# EAGLE schematic remotecontroll (EAGLE 9.2.2)
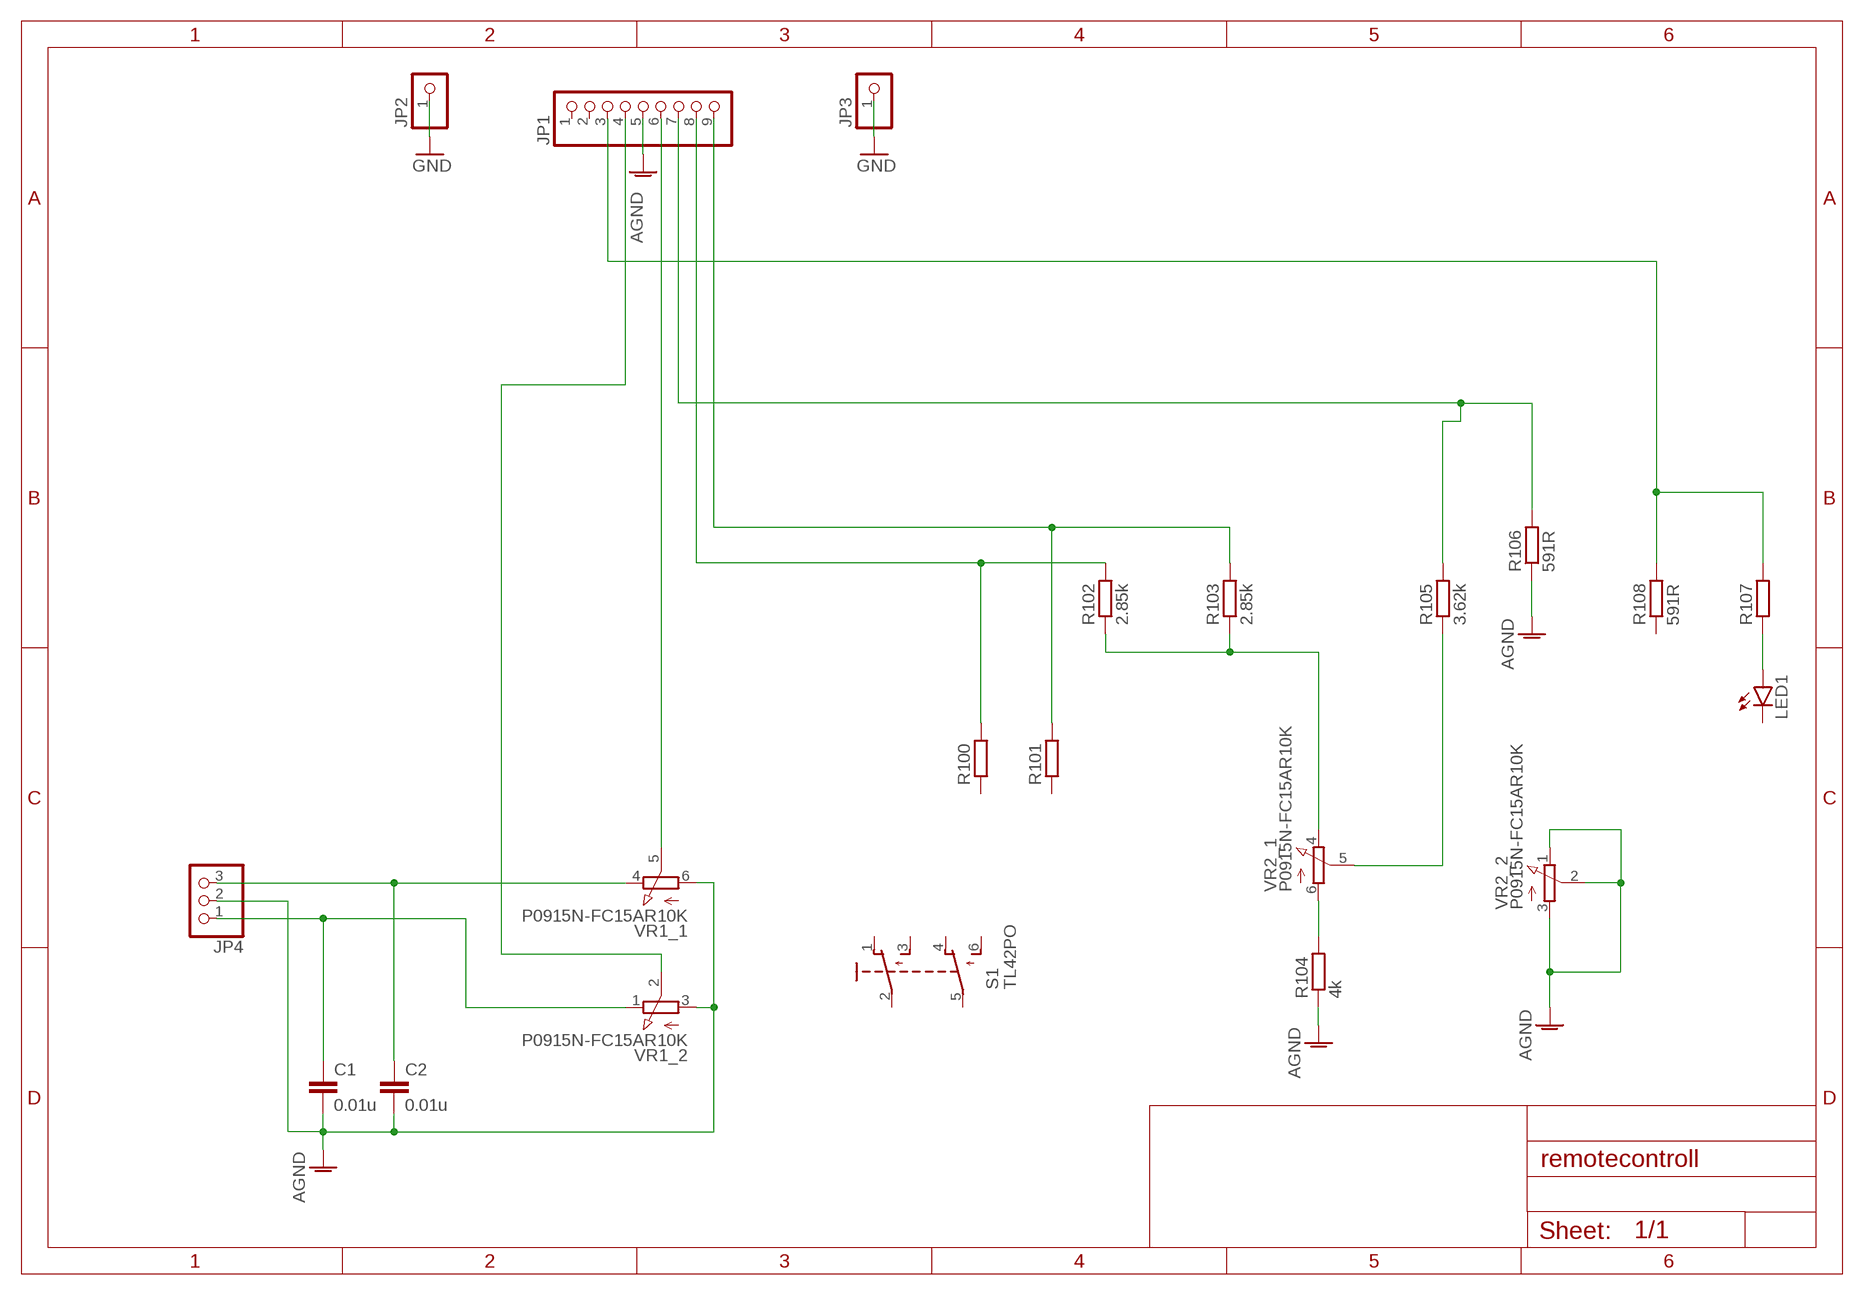
[diagram p0: schematic, sheet 1]

## Parts
C1  0.01u  C-EUC0603  [C0603]
C2  0.01u  C-EUC0603  [C0603]
JP1  PINHD-1X9  [1X09]
JP2  PINHD-1X1  [1X01]
JP3  PINHD-1X1  [1X01]
JP4  PINHD-1X3  [1X03]
LED1  LED3MM  [LED3MM]
R100  R-EU_0207/10  [0207/10]
R101  R-EU_0207/10  [0207/10]
R102  2.85k  R-EU_0204/7  [0204/7]
R103  2.85k  R-EU_0204/7  [0204/7]
R104  4k  R-EU_0204/7  [0204/7]
R105  3.62k  R-EU_0204/7  [0204/7]
R106  591R  R-EU_0204/7  [0204/7]
R107  R-EU_0207/10  [0207/10]
R108  591R  R-EU_0204/7  [0204/7]
S1  TL42PO  [TL4XPO]
VR1  P0915N-FC15AR10K  [P0915NFC15AR10K]
VR2  P0915N-FC15AR10K  [P0915NFC15AR10K]

## Nets
AGND: C1.2 C2.2 JP1.5 JP4.2 R104.1 R106.1 VR1.3(_2:A) VR1.6(_1:A) VR2.1(_2:E) VR2.2(_2:S) VR2.3(_2:A)
GND: JP2.1 JP3.1
N$1: JP1.6 VR1.5(_1:S)
N$2: C2.1 JP4.3 VR1.4(_1:E)
N$3: C1.1 JP4.1 VR1.1(_2:E)
N$4: JP1.4 VR1.2(_2:S)
N$5: JP1.7 R105.2 R106.2
N$6: JP1.8 R100.2 R102.2
N$7: JP1.9 R101.2 R103.2
N$8: LED1.A R107.1
N$9: JP1.3 R107.2 R108.2
N$10: R104.2 VR2.6(_1:A)
N$11: R105.1 VR2.5(_1:S)
N$12: R102.1 R103.1 VR2.4(_1:E)
Unconnected: JP1.1 JP1.2 LED1.K(C) R100.1 R101.1 R108.1 S1.1(O) S1.2(P) S1.3(S) S1.4(O1) S1.5(P1) S1.6(S1)

## Library data of the parts
C1 C2 = resistor:C-EU: CAPACITOR, European symbol
JP1 = pinhead:PINHD-1X9: PIN HEADER
JP2 JP3 = pinhead:PINHD-1X1: PIN HEADER
JP4 = pinhead:PINHD-1X3: PIN HEADER
LED1 = led:LED: LED OSRAM: - CHIPLED LG R971, LG N971, LY N971, LG Q971, LY Q971, LO R971, LY R971 LH N974, LH R974 LS Q976, LO Q976, LY Q976 LO Q996 - Hyper CHIPLED LW Q18S LB Q993, LB Q99A, LB R99A - SideLED LS A670, LO A670, LY A670, LG A670, LP A670 LB A673, LV A673, LT A673, LW A673 LH A674 LY A675 LS A676, LA A676, LO A676, LY A676, LW A676 LS A679, LY A679, LG A679 - Hyper Micro SIDELED® LS Y876, LA Y876, LO Y876, LY Y876 LT Y87S - SmartLED LW L88C, LW L88S LB L89C, LB L89S, LG L890 LS L89K, LO L89K, LY L89K LS L896, LA L896, LO L896, LY L896 - TOPLED LS T670, LO T670, LY T670, LG T670, LP T670 LSG T670, LSP T670, LSY T670, LOP T670, LYG T670 LG T671, LOG T671, LSG T671 LB T673, LV T673, LT T673, LW T673 LH T674 LS T676, LA T676, LO T676, LY T676, LB T676, LH T676, LSB T676, LW T676 LB T67C, LV T67C, LT T67C, LS T67K, LO T67K, LY T67K, LW E67C LS E67B, LA E67B, LO E67B, LY E67B, LB E67C, LV E67C, LT E67C LW T67C LS T679, LY T679, LG T679 LS T770, LO T770, LY T770, LG T770, LP T770 LB T773, LV T773, LT T773, LW T773 LH T774 LS E675, LA E675, LY E675, LS T675 LS T776, LA T776, LO T776, LY T776, LB T776 LHGB T686 LT T68C, LB T68C - Hyper Mini TOPLED® LB M676 - Mini TOPLED Santana® LG M470 LS M47K, LO M47K, LY M47K Source: http://www.osram.convergy.de LUXEON: - LUMILED® LXK2-PW12-R00, LXK2-PW12-S00, LXK2-PW14-U00, LXK2-PW14-V00 LXK2-PM12-R00, LXK2-PM12-S00, LXK2-PM14-U00 LXK2-PE12-Q00, LXK2-PE12-R00, LXK2-PE12-S00, LXK2-PE14-T00, LXK2-PE14-U00 LXK2-PB12-K00, LXK2-PB12-L00, LXK2-PB12-M00, LXK2-PB14-N00, LXK2-PB14-P00, LXK2-PB14-Q00 LXK2-PR12-L00, LXK2-PR12-M00, LXK2-PR14-Q00, LXK2-PR14-R00 LXK2-PD12-Q00, LXK2-PD12-R00, LXK2-PD12-S00 LXK2-PH12-R00, LXK2-PH12-S00 LXK2-PL12-P00, LXK2-PL12-Q00, LXK2-PL12-R00 Source: www.luxeon.com KINGBRIGHT: KA-3528ASYC Source: www.kingbright.com
R100-R108 = resistor:R-EU_: RESISTOR, European symbol
S1 = switch:TL42PO: TINY SWITCH ON - MOM Source: http://www2.produktinfo.conrad.com/datenblaetter/700000-724999/705152-da-01-de-Subminiaturschalter_TL_36YO.pdf
VR1 VR2 = Logitech:P0915N-FC15AR10K